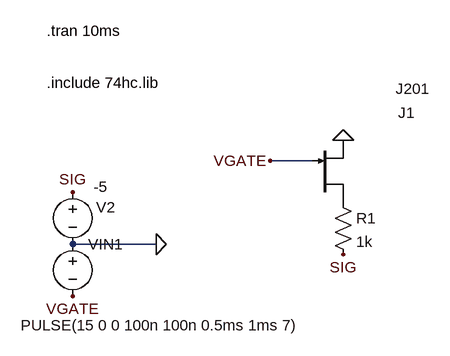
[diagram p0: schematic Draft59.asc]
Draft59.asc, the LTspice schematic file:
Version 4
SHEET 1 2756 1020
WIRE 32 0 -32 0
WIRE -208 128 -336 128
FLAG -336 48 SIG
FLAG 80 -32 0
FLAG -32 0 VGATE
FLAG -208 128 0
FLAG -336 208 VGATE
FLAG 80 144 SIG
SYMBOL voltage -336 112 R0
WINDOW 123 0 0 Left 0
WINDOW 39 0 0 Left 0
WINDOW 3 -80 141 Left 2
SYMATTR Value PULSE(15 0 0 100n 100n 0.5ms 1ms 7)
SYMATTR InstName VIN1
SYMBOL njf 32 64 M180
WINDOW 0 158 138 Right 2
WINDOW 3 181 175 Right 2
SYMATTR InstName J1
SYMATTR Value J201
SYMBOL voltage -336 32 R0
WINDOW 123 0 0 Left 0
WINDOW 39 0 0 Left 0
WINDOW 0 36 39 Left 2
WINDOW 3 32 8 Left 2
SYMATTR InstName V2
SYMATTR Value -5
SYMBOL res 64 48 R0
SYMATTR InstName R1
SYMATTR Value 1k
TEXT -376 -200 Left 2 !.tran 10ms
TEXT -376 -120 Left 2 !.include 74hc.lib

The netlist it stands for:
* Draft59.asc
VIN1 0 VGATE PULSE(15 0 0 100n 100n 0.5ms 1ms 7)
J1 P001 VGATE 0 J201
V2 SIG 0 -5
R1 P001 SIG 1k
.model NJF NJF
.model PJF PJF
.lib standard.jft
.tran 10ms
.include 74hc.lib
.backanno
.end